# EAGLE design EnvironmentMonitorV4.1 (EAGLE 7.4.0)
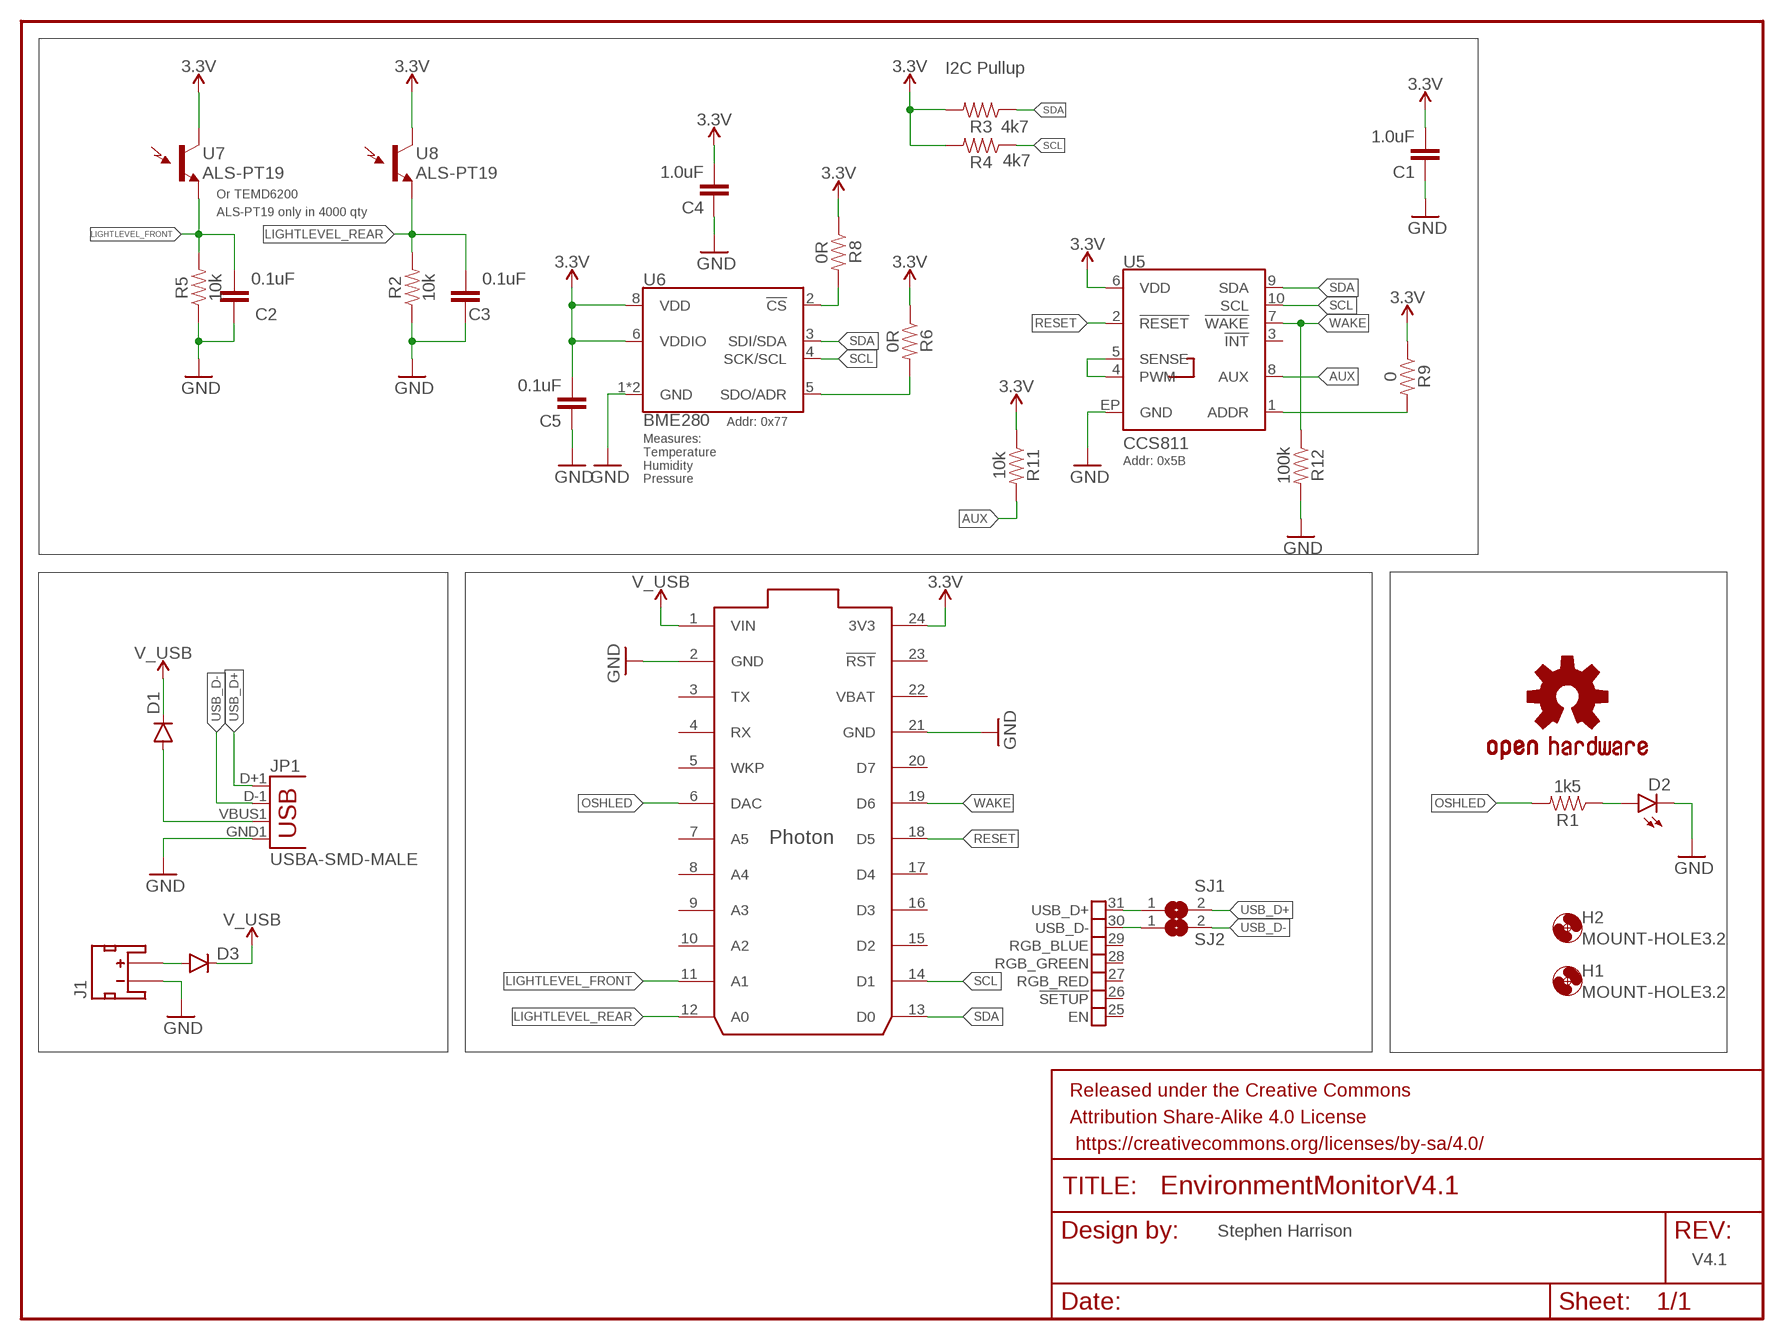
[diagram p0: schematic, sheet 1]

## Parts
C1  1.0uF  1.0UF-25V-+80/-20(0805)"  [0805-CAP]
C2  0.1uF  1.0UF-25V-+80/-20(0805)"  [0805-CAP]
C3  0.1uF  1.0UF-25V-+80/-20(0805)"  [0805-CAP]
C4  1.0uF  1.0UF-25V-+80/-20(0805)"  [0805-CAP]
C5  0.1uF  1.0UF-25V-+80/-20(0805)"  [0805-CAP]
D1  DIODESMA  [SMA-DIODE]
D2  LED1206-BOTTOM  [LED-1206-BOTTOM]
D3  DIODESMA  [SMA-DIODE]
FRAME1  FRAME-LETTER  [CREATIVE_COMMONS]
H1  MOUNT-HOLE3.2  [3,2]
H2  MOUNT-HOLE3.2  [3,2]
J1  JST_2MM_MALE  [JST-2-SMD]
JP1  USBA-SMD-MALE  [USB-A-SMT-MALE]
LOGO1  OSHW-LOGOM  [OSHW-LOGO-M]
R1  1k5  RESISTOR0805  [0805]
R2  10k  RESISTOR0805  [0805]
R3  4k7  RESISTOR0805  [0805]
R4  4k7  RESISTOR0805  [0805]
R5  10k  RESISTOR0805  [0805]
R6  0R  RESISTOR0805  [0805]
R8  0R  RESISTOR0805  [0805]
R9  0  RESISTOR0805  [0805]
R11  10k  RESISTOR0805  [0805]
R12  100k  RESISTOR0805  [0805]
SJ1  SJ  [SJ]
SJ2  SJ  [SJ]
U5  CCS811  [LGA10]
U6  BME280  [LGA-8-2.5X2.5]
U7  ALS-PT19  LIGHT_SENSORALS  [ALS-PT19]
U8  ALS-PT19  LIGHT_SENSORALS  [ALS-PT19]
U$1  PHOTON_SMD  [PHOTON_SMD]

## Nets
3.3V: C1.2 C4.2 C5.2 R3.2 R4.2 R6.1 R8.1 R9.1 R11.1 U5.6(VDD) U6.6(VDDIO) U6.8(VDD) U7.C(C1) U8.C(C1) U$1.24(3V3)
AUX: R11.2 U5.8(AUX)
BME280_CS: R8.2 U6.2(!CS)
GND: C1.1 C2.1 C3.1 C4.1 C5.1 D2.C J1.1(-) JP1.GND1(GND) R2.1 R5.1 R12.2 U5.EP(GND) U6.1(GND) U6.7(GND) U$1.2(GND) U$1.21(GND)
LIGHTLEVEL_FRONT: C2.2 R5.2 U7.E(E1) U$1.11(A1)
LIGHTLEVEL_REAR: C3.2 R2.2 U8.E(E1) U$1.12(A0)
N$1: SJ1.1 U$1.31(USB_D+)
N$2: SJ2.1 U$1.30(USB_D-)
N$3: R6.2 U6.5(SDO/ADR)
N$4: D3.A J1.2(+)
N$5: D1.A JP1.VBUS1(VBUS)
N$6: D2.A R1.1
N$9: R9.2 U5.1(ADDR)
NTC_SENSE: U5.4(PWM) U5.5(SENSE)
OSHLED: R1.2 U$1.6(DAC)
RESET: U5.2(!RESET!) U$1.18(D5)
SCL: R4.1 U5.10(SCL) U6.4(SCK/SCL) U$1.14(D1)
SDA: R3.1 U5.9(SDA) U6.3(SDI/SDA) U$1.13(D0)
USB_D+: JP1.D+1(D+) SJ1.2
USB_D-: JP1.D-1(D-) SJ2.2
V_USB: D1.C D3.C U$1.1(VIN)
WAKE: R12.1 U5.7(!WAKE!) U$1.19(D6)
Unconnected: J1.NC1(PAD1) J1.NC2(PAD2) U5.3(!INT!) U$1.3(TX) U$1.4(RX) U$1.5(WKP) U$1.7(A5) U$1.8(A4) U$1.9(A3) U$1.10(A2) U$1.15(D2) U$1.16(D3) U$1.17(D4) U$1.20(D7) U$1.23(!RST) U$1.25(EN) U$1.26(!SETUP) U$1.27(RGB_RED) U$1.28(RGB_GREEN) U$1.29(RGB_BLUE)

## Notes on the sheet
- I2C Pullup
- Or TEMD6200
- ALS-PT19 only in 4000 qty
- Addr: 0x77
- Addr: 0x5B
- Measures:
  Temperature
  Humidity
  Pressure
- Stephen Harrison
- V4.1

## Power pins joined to a net without a drawn wire
VBAT: U$1.22(VBAT)

## Library data of the parts
C1 C4 = SparkFun-Capacitors:1.0UF-25V-+80/-20(0805): CAP-11625; PROD_ID: CAP-11625
C2 C3 C5 = SparkFun-Capacitors:1.0UF-25V-+80/-20(0805): CAP-11625; PROD_ID: CAP-11625; VALUE: 1.0uF
D1 D3 = SparkFun-DiscreteSemi:DIODE: Diode These are standard reverse protection diodes and small signal diodes. SMA package can handle up to about 1A. SOD-323 can handle about 200mA. What the SOD-323 package when ordering, there are some mfgs out there that are 5-pin packages.
D2 = SparkFun-LED:LED: LEDs Standard schematic elements and footprints for 5mm, 3mm, 1206, and 0603 sized LEDs. 5mm - Spark Fun Electronics SKU : COM-00529 (and others)
FRAME1 = SparkFun-Aesthetics:FRAME-LETTER: Schematic Frame - Letter Standard 8.5x11 US Letter frame
H1 H2 = holes:MOUNT-HOLE: MOUNTING HOLE with drill center marker
J1 = SparkFun-Connectors:JST_2MM_MALE: Mates to single-cell LiPo batteries. CONN-11443 Now with smashable polarity marks!; BTM_NEG: -; BTM_POS: +; PROD_ID: CONN-11443; TOP_NEG: -; TOP_POS: +
JP1 = Tinamous:USB: USB Connectors USB-B-PTH is fully proven SKU : PRT-00139/CONN-08278 USB-miniB is fully proven SKU : PRT-00587 USB-A-PCB is untested. USB-A-H is throughly reviewed, but untested. Spark Fun Electronics SKU : PRT-00437 USB-B-SMT is throughly reviewed, but untested. Needs silkscreen touching up. USB-A-S has not been used/tested USB-MB-H has not been used/tested USB-MICROB has been used. CONN-09505
LOGO1 = SparkFun-Aesthetics:OSHW-LOGO: Open-Source Hardware (OSHW) Logo This logo indicates the piece of hardware it is found on incorporates a OSHW license and/or adheres to the definition of open source hardware found here: http://freedomdefined.org/OSHW
R1-R6 R8 R9 R11 R12 = SparkFun-Resistors:RESISTOR: Generic Resistor Package
SJ1 SJ2 = jumper:SJ: SMD solder JUMPER
U5 = CCS811_Breakout_Temp:CCS811: AMS CCS811 – I2C Digital Gas Sensor Ultra-Low Power Digital Gas Sensor for Monitoring Indoor Air Quality AMS Product Page <http://ams.com/eng/Products/Environmental-Sensors/Gas-Sensors/CCS811> SparkFun Products:; PROD_ID: IC-13607
U6 = SparkFun-Sensors:BME280: Bosch BME280 – Combined Humidity and Pressure Sensor The BME280 is as combined digital humidity, pressure and temperature sensor based on proven sensing principles. The sensor module is housed in an extremely compact metal-lid LGA package with a footprint of only 2.5×2.5mm² with a height of 0.93mm. Its small dimensions and its low power consumption allow the implementation in battery driven devices such as handsets, GPS modules or watches. Datasheet <https://cdn.sparkfun.com/assets/learn_tutorials/4/1/9/BST-BME280_DS001-10.pdf> SparkFun Products SparkFun Atmospheric Sensor Breakout - BME280 <https://www.sparkfun.com/products/13676> (SEN-13676); PROD_ID: IC-13090
U7 U8 = SparkFun-Sensors:LIGHT_SENSOR: Ambient Light Sensors - Phototransistors Low cost ambient light sensors, consisting of a phototransistor in miniature SMD packages. Output voltage varies with light intensity. SparkFun Products ALS-PT19 Light Sensor <https://www.sparkfun.com/products/12566> (SEN-12566) Ambient Light Sensor - TEMT6000 <https://www.sparkfun.com/products/8348> (SEN-08348) SparkFun Ambient Light Sensor Breakout - TEMT60000 <https://www.sparkfun.com/products/8688> (SEN-08688); PROD_ID: IC-11836; SF_ID: SEN-12566
U$1 = Tinamous:PHOTON_SMD: Photon (without headers) - designed to be surface mounted with 7 extra exposed pads on the bottom of the board which include, 3 RGB LED outputs, /SETUP, EN (3.3V SMPS enable input), USB D+ and USB D-.

## Board
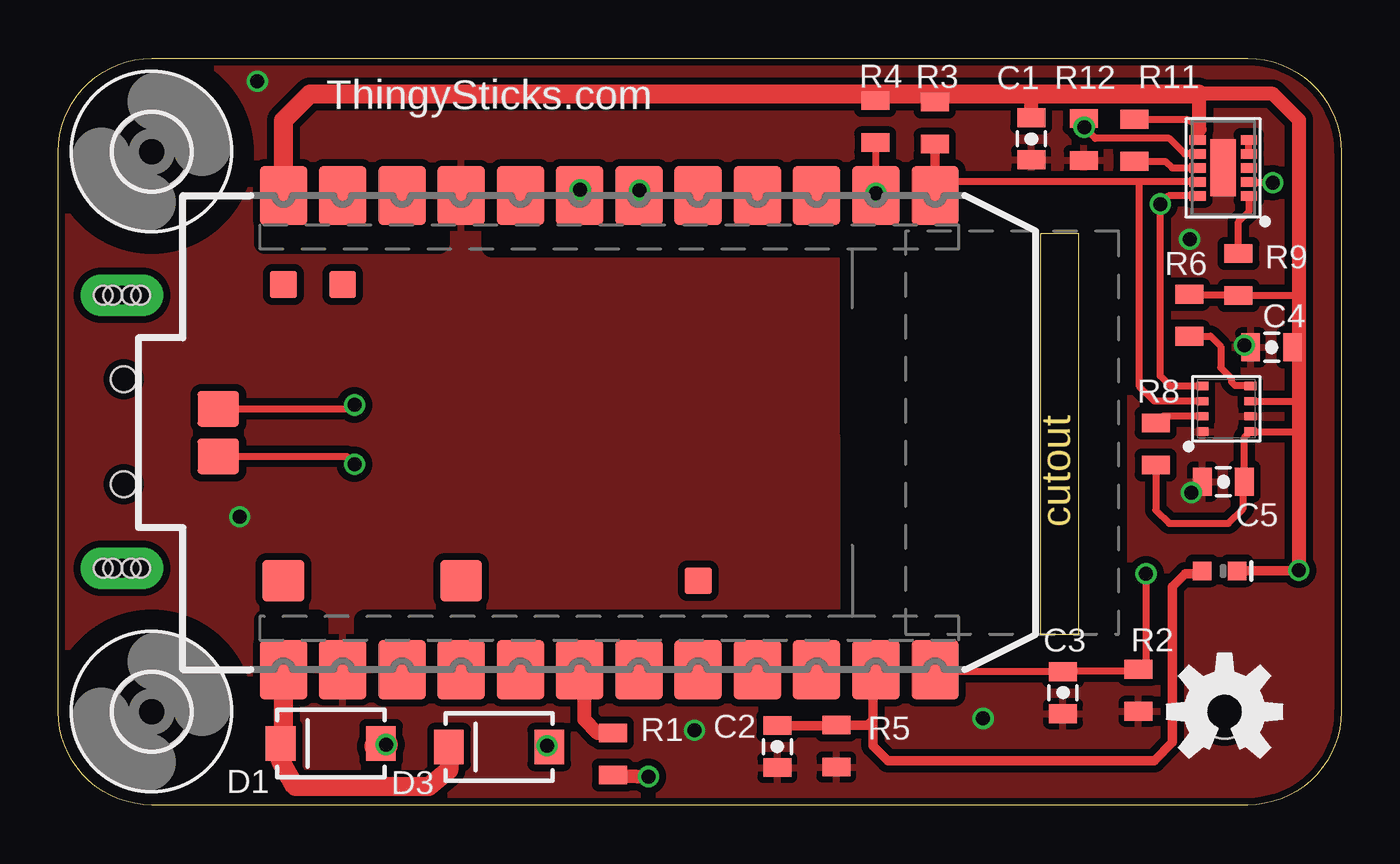
[diagram p1: board, top side]
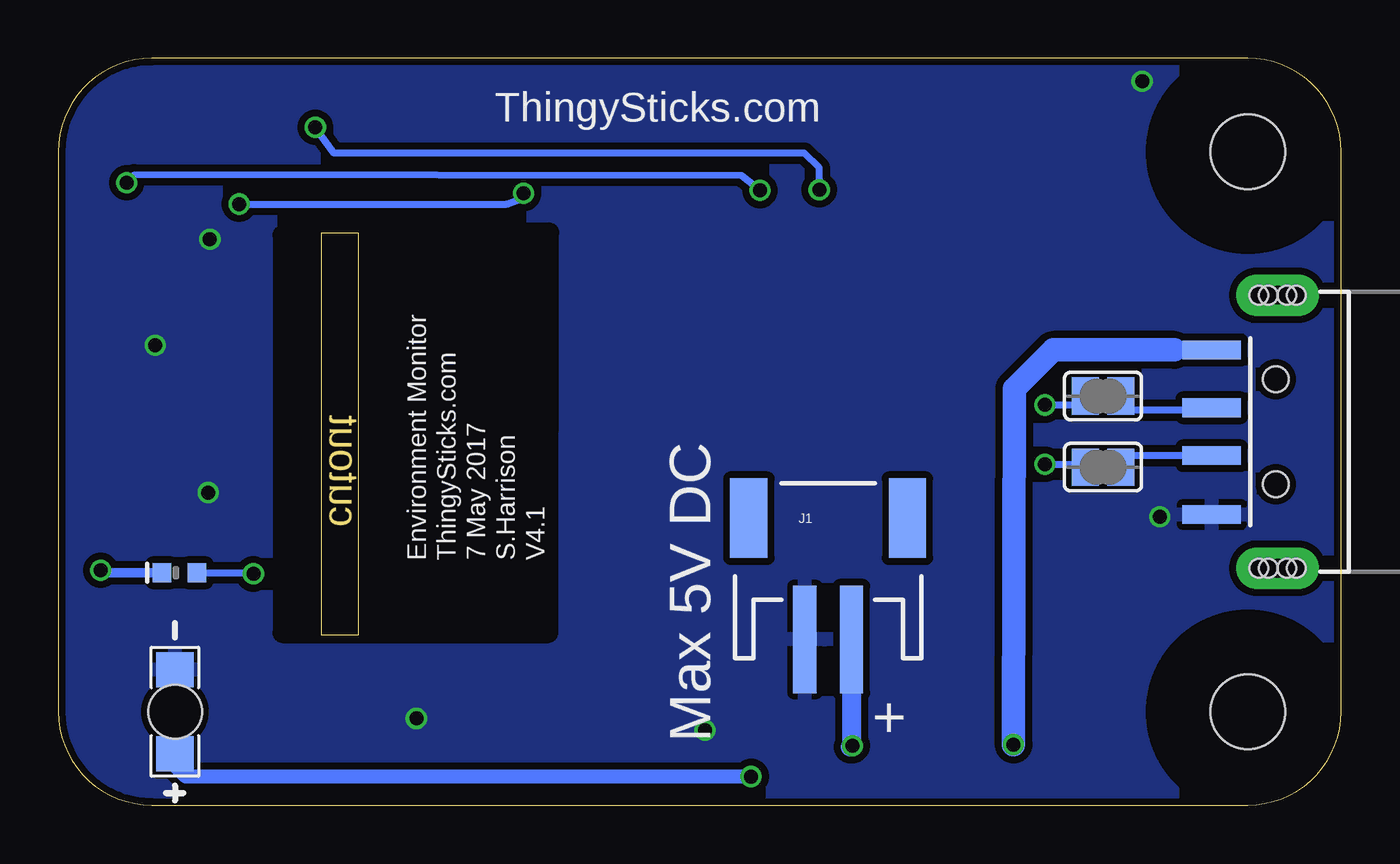
[diagram p2: board, bottom side, seen from below]

Size 55 x 32 mm. Coordinates in mm from the lower left corner, seen from the top.
Outline: 0,4 0,28 arc-90 4,32 51,32 arc-90 55,28 55,4 arc-90 51,0 4,0 arc-90 0,4
Outline: 42.13,24.5 43.73,24.5 43.73,7.3 42.13,7.3 42.13,24.5
Copper layers (1*16): Top 0.035mm / dielectric 1.5mm / Bottom 0.035mm
Design rules "dirt_cheap_dirty_boards.v1": minimum track width 5mil, minimum drill 12mil, track to track 5mil, track to pad 5mil, pad to pad 5mil, via to via 5mil, smd to smd 0mil, copper to edge 10mil, drill to drill 10mil, minimum pad ring 10mil, minimum via ring 6mil, stop-mask expansion 2mil, vias tented up to drill 25mil, thermal gap 10mil
tRestrict: area 33.9,7.2 to 45.4,24.5; area 13.1,7.3 to 38.4,7.9; area 18.6,23.9 to 38.4,24.7; area 8.8,24.1 to 16.3,24.7; area 8.8,7.2 to 11.1,7.9
bRestrict: area 34,7.4 to 45.4,24.5

### Footprints (pad centres in the part's own frame; a part is rotated, then mirrored left to right if it is on the bottom)
0805-CAP = smd 0.8 x 1.2: 1 -0.9,0; 2 0.9,0
SMA-DIODE = smd 1.27 x 1.47: A -2.15,0; C 2.15,0
LED-1206-BOTTOM = smd 1.5 x 1.6: A -1.8,0; C 1.8,0 | hole 2.3: 0,0
3,2 = hole 3.2: 0,0
JST-2-SMD = smd 1 x 4.6: 1 -1,-3.7; 2 1,-3.7 | smd 1.6 x 3.4: NC1 -3.4,1.5; NC2 3.4,1.5
USB-A-SMT-MALE = smd 0.8 x 2.5: D+1 1.027,-5.87; D-1 -1.027,-5.87; GND1 3.551,-5.87; VBUS1 -3.5,-5.87 | drill 0.8 pad 1.778 long: P$1 5.85,-3.05; P$3 -5.85,-3.05 | hole 1.1: 2.25,-3.12; -2.25,-3.12 | hole 0.8: -5.85,-3.45; -5.85,-3.85; -5.85,-2.65; -5.85,-2.25; 5.85,-3.45; 5.85,-3.85; 5.85,-2.65; 5.85,-2.25
0805 = smd 0.8 x 1.2: 1 -0.9,0; 2 0.9,0
SJ = smd 1.168 x 1.6: 1 -0.762,0; 2 0.762,0
LGA10 = smd 0.7 x 0.4: 1 -1.1,1.2; 2 -1.1,0.6; 3 -1.1,0; 4 -1.1,-0.6; 5 -1.1,-1.2; 6 1.1,-1.2; 7 1.1,-0.6; 8 1.1,0; 9 1.1,0.6; 10 1.1,1.2 | smd 1.1 x 2.45: EP 0,0
LGA-8-2.5X2.5 = smd 0.35 x 0.5: 1 -0.975,1.025; 2 -0.325,1.025; 3 0.325,1.025; 4 0.975,1.025; 5 0.975,-1.025; 6 0.325,-1.025; 7 -0.325,-1.025; 8 -0.975,-1.025
ALS-PT19 = smd 0.8 x 0.8: C -0.75,0; E 0.75,0
PHOTON_SMD = smd 2.54 x 2.032: 1 0,32.258; 2 0,29.718; 3 0,27.178; 4 0,24.638; 5 0,22.098; 6 0,19.558; 7 0,17.018; 8 0,14.478; 9 0,11.938; 10 0,9.398; 11 0,6.858; 12 0,4.318; 13 20.32,4.318; 14 20.32,6.858; 15 20.32,9.398; 16 20.32,11.938; 17 20.32,14.478; 18 20.32,17.018; 19 20.32,19.558; 20 20.32,22.098; 21 20.32,24.638; 22 20.32,27.178; 23 20.32,29.718; 24 20.32,32.258 | smd 1.778 x 1.778: 25 3.81,32.258; 26 3.81,24.638 | smd 1.143 x 1.143: 27 3.81,14.478; 28 16.51,29.718; 29 16.51,32.258 | smd 1.524 x 1.778: 30 11.176,35.052; 31 9.144,35.052

### Placement (x,y rotation side)
C1  41.71,28.55 90 top
C2  30.82,2.5 90 top
C3  43.08,4.81 90 top
C4  52.02,19.61 0 top
C5  49.95,13.86 0 top
D1  11.68,2.64 180 top
D2  50,4 90 bottom
D3  18.9,2.49 180 top
FRAME1  0,-12.7 0 top  (outside the outline)
H1  4,4 0 top
H2  4,28 0 top
J1  22,10.79 0 bottom
JP1  -0.32,16 270 bottom
LOGO1  50,4 0 top
R1  23.77,2.18 90 top
R2  46.3,4.91 90 top
R3  37.58,29.22 90 top
R4  35.03,29.29 90 top
R5  33.35,2.53 90 top
R6  48.49,20.99 270 top
R8  47.05,15.47 90 top
R9  50.6,22.74 90 top
R11  46.13,28.49 270 top
R12  43.97,28.52 270 top
SJ1  10.21,14.48 0 bottom
SJ2  10.21,17.53 0 bottom
U5  49.94,27.3 180 top
U6  50.08,16.98 90 top
U7  49.78,10.03 180 top
U8  49.81,9.96 0 bottom
U$1  41.91,5.8 90 top

### Tracks (layer width: path | path; a pad name or v marks a point on that pad's centre or on a via)
3.3V  (via drill 0.6)
  Top 0.305: R11.1 48.41,29.39 48.82,29.13 48.82,28.52 U5.6 | U5.6 48.84,29.15 | R3.2 39.42,30.43 39.37,30.48 | R4.2 33.21,30.29 33.02,30.48 | U5.6 48.84,28.87 48.92,28.96 | R6.1 48.55,21.84 R9.1 52.94,21.84 53.19,21.59 | U6.6 53.02,17.31 53.19,17.14 | C4.2 53.11,19.61 53.19,19.68 | 53.19,15.88 53.05,16.01 U6.8 50.85,15.75 C5.2 50.8,13.81 50.8,12.7 50.16,12.06 47.62,12.06 47.05,12.64 R8.1
  Top 0.406: U7.C 53.16,10.03 v53.19,10.06
  Top 0.61: 48.92,28.96 48.92,30.33 48.77,30.48 | C1.2 41.71,30.28 41.91,30.48 | 48.9,30.48 52.07,30.48 53.19,29.36 53.19,21.59 53.19,19.68 53.19,17.14 53.19,15.88 v53.19,10.06
  Top 0.813: U$1.24 9.65,29.34 10.79,30.48 33.02,30.48 39.37,30.48 41.91,30.48 48.77,30.48 48.9,30.48
  Bottom 0.406: v53.19,10.06 | U8.C 53.08,9.96 v53.19,10.06
  Bottom 0.61: v53.19,10.06
AUX
  Top 0.305: R11.2 47.47,27.59 47.75,27.3 U5.8
BME280_CS
  Top 0.305: U6.2 47.34,16.66 R8.2
GND  (via drill 0.6)
  Top 0.305: v50.84,19.7 51.03,19.7 C4.1
  other vias: 7.77,12.36 48.57,13.39 39.65,3.71 48.5,24.24 27.28,3.2 8.53,31.01
  pour Bottom (isolate 0.305): 55.88,32.38 55.88,-0.64 -0.64,-0.64 -0.64,32.38
  pour Top (isolate 0.305): -0.64,32.38 55.24,32.38 55.24,-0.64 -0.64,-0.64
LIGHTLEVEL_FRONT
  Top 0.406: 34.92,3.66 34.92,2.54 35.56,1.91 46.99,1.91 47.76,2.68 47.76,9.36 48.31,9.91 48.91,9.91 U7.E | 34.92,3.66 34.92,5.59 U$1.11 | 34.92,3.66 34.7,3.43 R5.2 33.33,3.4 C2.2
LIGHTLEVEL_REAR  (via drill 0.6)
  Top 0.305: 37.68,5.71 U$1.12 37.68,5.71 C3.2 43.1,5.74 45.8,5.74 R2.2 46.63,6.14 v46.63,9.91
  Bottom 0.305: U8.E 46.69,9.96 v46.63,9.91
N$1  (via drill 0.6)
  Top 0.305: U$1.31 12.36,14.94 v12.7,14.61
  Bottom 0.305: v12.7,14.61 11.28,14.61 SJ1.1
N$2  (via drill 0.6)
  Top 0.305: U$1.30 12.53,16.98 v12.7,17.14
  Bottom 0.305: v12.7,17.14 11.05,17.14 SJ2.1
N$3
  Top 0.305: R6.2 49.4,20.09 49.84,19.66 49.84,18.75 50.29,18.29 50.29,18.14 50.44,17.98 51.07,17.98 U6.5
N$4  (via drill 0.6)
  Top 0.813: v20.95,2.54 21,2.54 D3.A
  Bottom 0.813: J1.2 21,2.54 D3.A 21.01,2.49 v20.95,2.54
N$5  (via drill 0.6)
  Top 0.813: 13.97,2.76 D1.A
  Top 1.016: 13.97,2.76 13.61,2.52 v14.05,2.59
  Bottom 0.61: JP1.VBUS1 7.16,19.5 7.16,19.51
  Bottom 1.016: v14.05,2.59 14.02,17.83 12.34,19.51 7.16,19.51
N$6  (via drill 0.6)
  Top 0.61: R1.1 v25.3,1.22
  Bottom 0.61: v25.3,1.22 49.53,1.22 50.37,2.06 D2.A
N$9
  Top 0.305: R9.2 50.6,25 51.05,25.45 51.05,26.09 U5.1
NTC_SENSE
  Top 0.305: U5.4 U5.5
OSHLED
  Top 0.61: R1.2 23.13,3.08 22.55,3.66 22.59,5.47 U$1.6
RESET  (via drill 0.6)
  Top 0.305: U$1.18 24.89,26.16 v24.92,26.34 | v52.07,26.67 51.07,26.67 U5.2
  Bottom 0.305: v24.92,26.34 25.7,26.98 51.74,27 v52.07,26.67
SCL  (via drill 0.6)
  Top 0.305: U$1.14 v35.05,26.21 35.01,26.1 R4.1 | 48.9,26.04 U5.10 47.59,26.11 v47.24,25.76 47.24,18.39 47.68,17.96 U6.4
  Bottom 0.305: v47.24,25.76 35.79,25.76 35.05,26.04 v35.05,26.21
SDA
  Top 0.305: U5.9 46.35,26.7 | 46.35,26.7 38.26,26.7 U$1.13 37.62,26.06 | U6.3 46.98,17.31 46.35,17.93 46.35,26.7
  Top 0.406: R3.1 37.58,26.05 U$1.13
USB_D+
  Bottom 0.305: 5.49,14.78 JP1.D+1 8.93,14.97 SJ1.2
USB_D-
  Bottom 0.305: JP1.D-1 5.54,16.92 9.04,16.92 SJ2.2
V_USB
  Top 0.813: 9.67,5.55 U$1.1 9.65,2.34 D1.C 9.53,2.33 9.53,1.91 10.16,0.79 15.88,0.79 16.75,1.51 D3.C
WAKE  (via drill 0.6)
  Top 0.305: U5.7 48.3,27.91 47.62,28.57 44.45,28.57 v43.98,29.05 | v43.98,29.05 43.81,29.21 R12.1 44.13,29.26 v43.98,29.05 | U$1.19 22.35,26.54 v22.38,26.36
  Bottom 0.305: v22.38,26.36 22.38,27.3 23.01,27.94 43.18,27.94 v43.98,29.05

### Text on the board
Dimension: cutout
tNames: ThingySticks.com
bNames: ThingySticks.com | Max 5V DC | V4.1 | S.Harrison | 7 May 2017 | ThingySticks.com | Environment Monitor | +